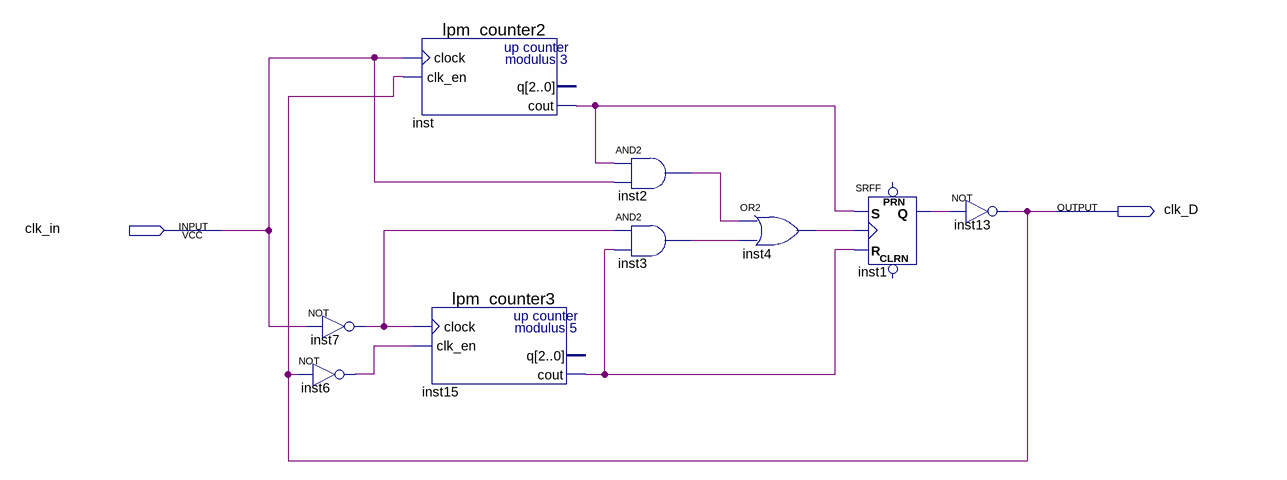
[diagram p0: schematic sheet]
// Quartus schematic block2.bdf as structural Verilog: 9 symbols, 2 pins
module block2 (
  input  clk_in,
  output clk_D
);

  wire inst1_q, inst2_out, inst3_out, inst4_out, inst6_out, inst7_out, inst15_cout, inst_cout;

  not inst7 (inst7_out, clk_in);
  not inst6 (inst6_out, clk_D);
  lpm_counter2 inst (.clock(clk_in), .clk_en(clk_D), .cout(inst_cout));  // open: q
  lpm_counter3 inst15 (.clock(inst7_out), .clk_en(inst6_out), .cout(inst15_cout));  // open: q
  and inst2 (inst2_out, inst_cout, clk_in);
  and inst3 (inst3_out, inst7_out, inst15_cout);
  or inst4 (inst4_out, inst2_out, inst3_out);
  SRFF inst1 (.S(inst_cout), .R(inst15_cout), .CLK(inst4_out), .Q(inst1_q));  // open: PRN, CLRN
  not inst13 (clk_D, inst1_q);
endmodule
